# Altium schematic sheet Power.SchDoc
size A4
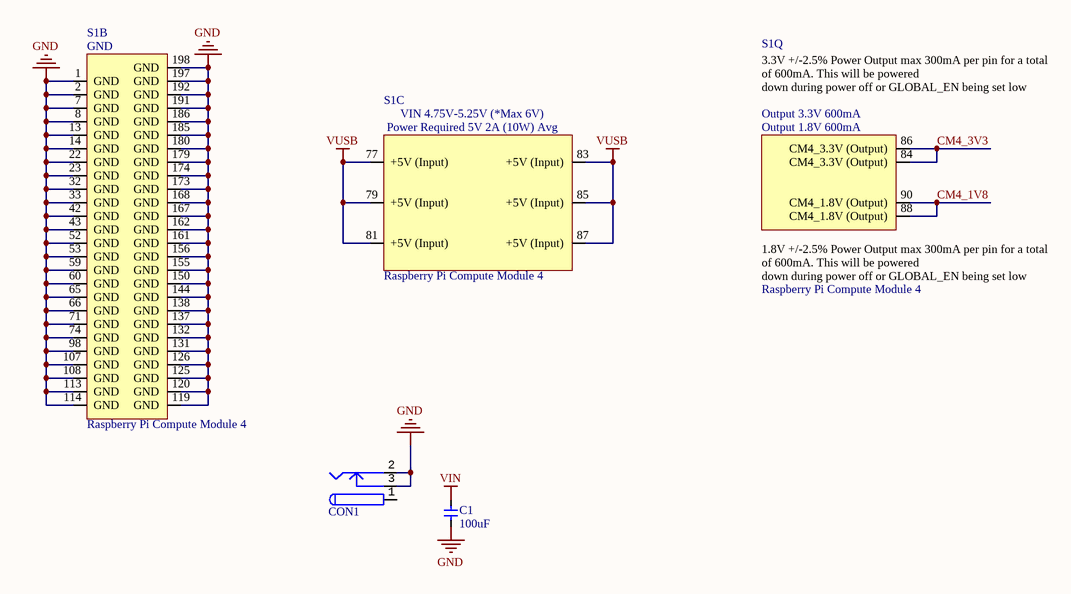
[diagram p0: Power.SchDoc]

## Parts
C1  100uF  [1206-CAP]
CON1  PowerJack_2.5  [KLD_0202]  (value not drawn)
S1  Raspberry Pi Compute Module 4  [CM4-F40C-100DS-0.4v_1.5mm_0mm]  (parts B,C,Q of 21)

## Nets
GND: C1.1 CON1.2 CON1.3 S1.1(GND) S1.2(GND) S1.7(GND) S1.8(GND) S1.13(GND) S1.14(GND) S1.22(GND) S1.23(GND) S1.32(GND) S1.33(GND) S1.42(GND) S1.43(GND) S1.52(GND) S1.53(GND) S1.59(GND) S1.60(GND) S1.65(GND) S1.66(GND) S1.71(GND) S1.74(GND) S1.98(GND) S1.107(GND) S1.108(GND) S1.113(GND) S1.114(GND) S1.119(GND) S1.120(GND) S1.125(GND) S1.126(GND) S1.131(GND) S1.132(GND) S1.137(GND) S1.138(GND) S1.144(GND) S1.150(GND) S1.155(GND) S1.156(GND) S1.161(GND) S1.162(GND) S1.167(GND) S1.168(GND) S1.173(GND) S1.174(GND) S1.179(GND) S1.180(GND) S1.185(GND) S1.186(GND) S1.191(GND) S1.192(GND) S1.197(GND) S1.198(GND)
VIN: C1.2
VUSB: S1.77(+5V_(Input)) S1.79(+5V_(Input)) S1.81(+5V_(Input)) S1.83(+5V_(Input)) S1.85(+5V_(Input)) S1.87(+5V_(Input))
CM4_1V8: S1.88(CM4_1.8V_(Output)) S1.90(CM4_1.8V_(Output))
CM4_3V3: S1.84(CM4_3.3V_(Output)) S1.86(CM4_3.3V_(Output))

Not connected (* = marked no-connect by the designer): CON1 1

## Notes on the sheet
- Title
- Size:
- Date:
- A4
- Number:
- Time:
- Revision:
- Sheet
- of
- Q-Wave Systems Co.,Ltd
- 65/2 Moo 1 Beung
- Sriracha Chonburi
- Thailand
- File:
- (in symbol CM4, part C) VIN 4.75V-5.25V (*Max 6V); Power Required 5V 2A (10W) Avg; by Amornthep Phunsin
- (in symbol CM4, part Q) 3.3V +/-2.5% Power Output max 300mA per pin for a total of 600mA. This will be powered / down during power off or GLOBAL_EN being set low; Output 3.3V 600mA; Output 1.8V 600mA; 1.8V +/-2.5% Power Output max 300mA per pin for a total of 600mA. This will be powered / down during power off or GLOBAL_EN being set low

## Library data of the parts
C1 = 电容-1206: Capacitor; Value: 0.1u
CON1 = PowerJack_2.5: DC Power Jack
S1 = CM4: Raspberry Pi Compute Module 4 by Amornthep Phunsin